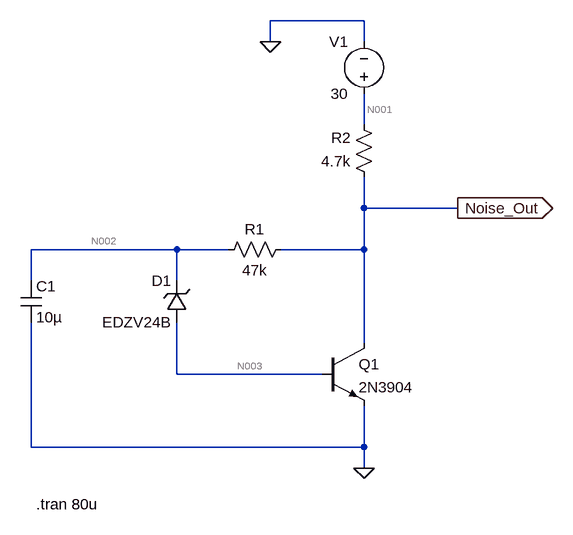
[diagram p0: schematic Draft1.asc]
Draft1.asc, the LTspice schematic file:
Version 4
SHEET 1 880 680
WIRE 480 -256 336 -256
WIRE 336 -224 336 -256
WIRE 480 -224 480 -256
WIRE 480 -96 480 -144
WIRE 480 32 480 -16
WIRE 624 32 480 32
WIRE 192 96 -32 96
WIRE 272 96 192 96
WIRE 480 96 480 32
WIRE 480 96 352 96
WIRE -32 144 -32 96
WIRE 192 144 192 96
WIRE 480 240 480 96
WIRE 192 288 192 208
WIRE 416 288 192 288
WIRE -32 400 -32 208
WIRE 480 400 480 336
WIRE 480 400 -32 400
WIRE 480 432 480 400
FLAG 480 432 0
FLAG 336 -224 0
FLAG 624 32 Noise_Out
IOPIN 624 32 Out
SYMBOL zener 208 208 R180
WINDOW 0 24 64 Left 2
WINDOW 3 24 0 Left 2
SYMATTR InstName D1
SYMATTR Value EDZV24B
SYMBOL cap -48 144 R0
SYMATTR InstName C1
SYMATTR Value 10µ
SYMBOL res 368 80 R90
WINDOW 0 0 56 VBottom 2
WINDOW 3 32 56 VTop 2
SYMATTR InstName R1
SYMATTR Value 47k
SYMBOL res 496 0 R180
WINDOW 0 36 76 Left 2
WINDOW 3 36 40 Left 2
SYMATTR InstName R2
SYMATTR Value 4.7k
SYMBOL npn 416 240 R0
SYMATTR InstName Q1
SYMATTR Value 2N3904
SYMBOL voltage 480 -128 R180
WINDOW 0 24 96 Left 2
WINDOW 3 24 16 Left 2
WINDOW 123 0 0 Left 0
WINDOW 39 0 0 Left 0
SYMATTR InstName V1
SYMATTR Value 30
TEXT -24 488 Left 2 !.tran 80u

The netlist it stands for:
* Draft1.asc
D1 N003 N002 EDZV24B
C1 N002 0 10µ
R1 Noise_Out N002 47k
R2 Noise_Out N001 4.7k
Q1 Noise_Out N003 0 0 2N3904
V1 N001 0 30
.model D D
.lib standard.dio
.model NPN NPN
.model PNP PNP
.lib standard.bjt
.tran 80u
.backanno
.end

* Results of the author's LTspice run, read from the files saved beside the schematic
* Operating Point, zero values left out:
*   V(n003) = 651.5 mV
*   V(n002) = 24.82 V
*   V(noise_out) = 24.96 V
*   V(n001) = 30 V
*   Ic(Q1) = 1.07 mA
*   Ib(Q1) = 2.874 µA
*   Ie(Q1) = -1.072 mA
*   I(D1) = -2.874 µA
*   I(R2) = -1.072 mA
*   I(R1) = 2.874 µA
*   I(V1) = -1.072 mA